# EAGLE design DE0_Digital_IO_Wing (EAGLE 6.6.0)
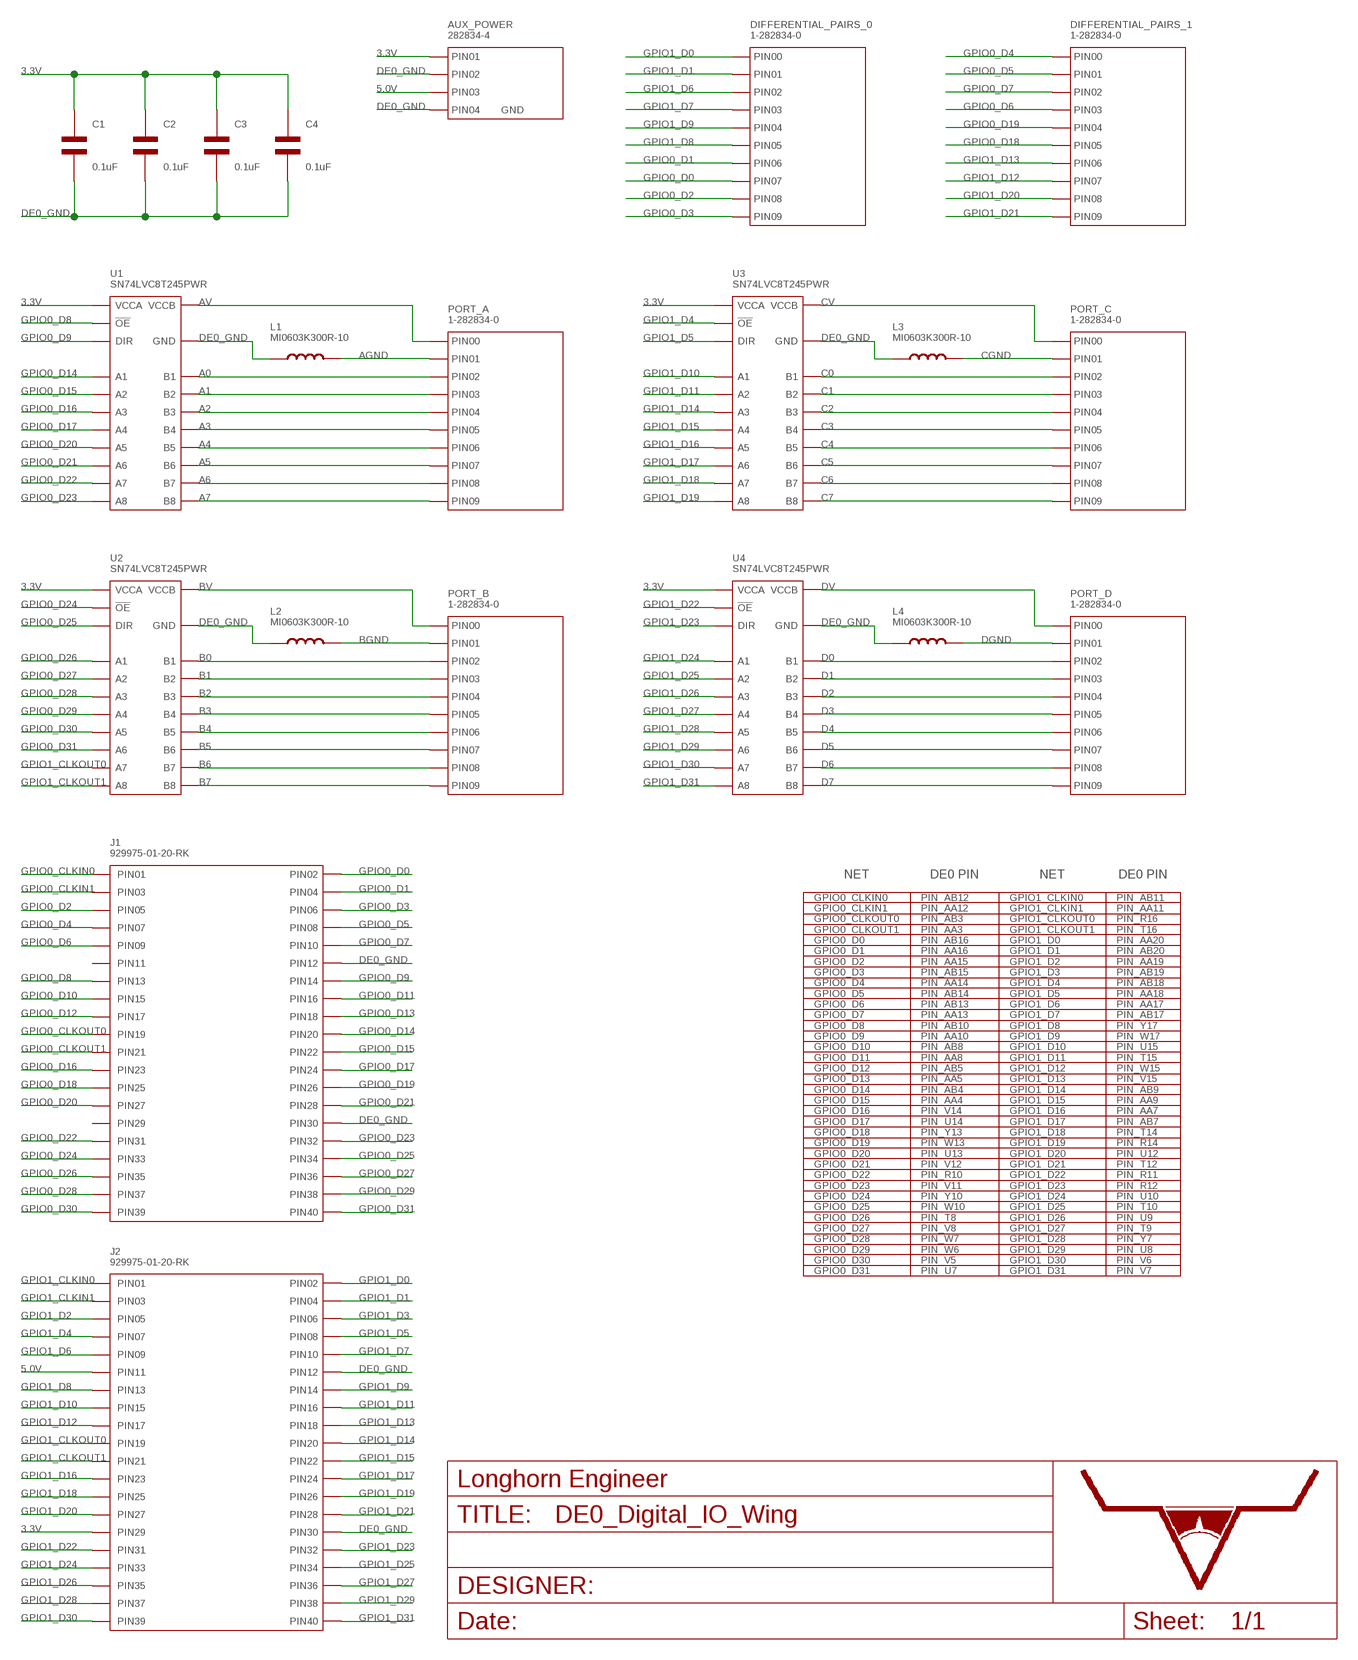
[diagram p0: schematic, sheet 1]

## Parts
AUX_POWER  282834-4  CON_01X04_282834-4  [282834-4]
C1  0.1uF  CAPACITOR_NP_0805  [C0805]
C2  0.1uF  CAPACITOR_NP_0805  [C0805]
C3  0.1uF  CAPACITOR_NP_0805  [C0805]
C4  0.1uF  CAPACITOR_NP_0805  [C0805]
DIFFERENTIAL_PAIRS_0  1-282834-0  PH_1X101-282834-0  [1-282834-0]
DIFFERENTIAL_PAIRS_1  1-282834-0  PH_1X101-282834-0  [1-282834-0]
FRAME  LHE_FRAME  [LHE_FRAME]
J1  929975-01-20-RK  CON_02X202.54MM_PIN_HEADER  [2.54MM_02X20_PIN_HEADER]
J2  929975-01-20-RK  CON_02X202.54MM_PIN_HEADER  [2.54MM_02X20_PIN_HEADER]
L1  MI0603K300R-10  INDUCTOR_0603  [L0603]
L2  MI0603K300R-10  INDUCTOR_0603  [L0603]
L3  MI0603K300R-10  INDUCTOR_0603  [L0603]
L4  MI0603K300R-10  INDUCTOR_0603  [L0603]
PORT_A  1-282834-0  PH_1X101-282834-0  [1-282834-0]
PORT_B  1-282834-0  PH_1X101-282834-0  [1-282834-0]
PORT_C  1-282834-0  PH_1X101-282834-0  [1-282834-0]
PORT_D  1-282834-0  PH_1X101-282834-0  [1-282834-0]
U1  SN74LVC8T245PWR  [SN74LVC8T245_TTSOP-24]
U2  SN74LVC8T245PWR  [SN74LVC8T245_TTSOP-24]
U3  SN74LVC8T245PWR  [SN74LVC8T245_TTSOP-24]
U4  SN74LVC8T245PWR  [SN74LVC8T245_TTSOP-24]

## Nets
3.3V: AUX_POWER.P$1 C1.P$1 C2.P$1 C3.P$1 C4.P$1 J2.29 U1.P$1(VCCA) U2.P$1(VCCA) U3.P$1(VCCA) U4.P$1(VCCA)
5.0V: AUX_POWER.P$3 J2.11
A0: PORT_A.P$3 U1.P$21(B1)
A1: PORT_A.P$4 U1.P$20(B2)
A2: PORT_A.P$5 U1.P$19(B3)
A3: PORT_A.P$6 U1.P$18(B4)
A4: PORT_A.P$7 U1.P$17(B5)
A5: PORT_A.P$8 U1.P$16(B6)
A6: PORT_A.P$9 U1.P$15(B7)
A7: PORT_A.P$10 U1.P$14(B8)
AGND: L1.P$2 PORT_A.P$2
AV: PORT_A.P$1 U1.P$23(VCCB) U1.P$24(VCCB)
B0: PORT_B.P$3 U2.P$21(B1)
B1: PORT_B.P$4 U2.P$20(B2)
B2: PORT_B.P$5 U2.P$19(B3)
B3: PORT_B.P$6 U2.P$18(B4)
B4: PORT_B.P$7 U2.P$17(B5)
B5: PORT_B.P$8 U2.P$16(B6)
B6: PORT_B.P$9 U2.P$15(B7)
B7: PORT_B.P$10 U2.P$14(B8)
BGND: L2.P$2 PORT_B.P$2
BV: PORT_B.P$1 U2.P$23(VCCB) U2.P$24(VCCB)
C0: PORT_C.P$3 U3.P$21(B1)
C1: PORT_C.P$4 U3.P$20(B2)
C2: PORT_C.P$5 U3.P$19(B3)
C3: PORT_C.P$6 U3.P$18(B4)
C4: PORT_C.P$7 U3.P$17(B5)
C5: PORT_C.P$8 U3.P$16(B6)
C6: PORT_C.P$9 U3.P$15(B7)
C7: PORT_C.P$10 U3.P$14(B8)
CGND: L3.P$2 PORT_C.P$2
CV: PORT_C.P$1 U3.P$23(VCCB) U3.P$24(VCCB)
D0: PORT_D.P$3 U4.P$21(B1)
D1: PORT_D.P$4 U4.P$20(B2)
D2: PORT_D.P$5 U4.P$19(B3)
D3: PORT_D.P$6 U4.P$18(B4)
D4: PORT_D.P$7 U4.P$17(B5)
D5: PORT_D.P$8 U4.P$16(B6)
D6: PORT_D.P$9 U4.P$15(B7)
D7: PORT_D.P$10 U4.P$14(B8)
DE0_GND: AUX_POWER.P$2 AUX_POWER.P$4 C1.P$2 C2.P$2 C3.P$2 C4.P$2 J1.12 J1.30 J2.12 J2.30 L1.P$1 L2.P$1 L3.P$1 L4.P$1 U1.P$11(GND) U1.P$12(GND) U1.P$13(GND) U2.P$11(GND) U2.P$12(GND) U2.P$13(GND) U3.P$11(GND) U3.P$12(GND) U3.P$13(GND) U4.P$11(GND) U4.P$12(GND) U4.P$13(GND)
DGND: L4.P$2 PORT_D.P$2
DV: PORT_D.P$1 U4.P$23(VCCB) U4.P$24(VCCB)
GPIO0_CLKIN0: J1.1
GPIO0_CLKIN1: J1.3
GPIO0_CLKOUT0: J1.19
GPIO0_CLKOUT1: J1.21
GPIO0_D0: DIFFERENTIAL_PAIRS_0.P$8 J1.2
GPIO0_D1: DIFFERENTIAL_PAIRS_0.P$7 J1.4
GPIO0_D2: DIFFERENTIAL_PAIRS_0.P$9 J1.5
GPIO0_D3: DIFFERENTIAL_PAIRS_0.P$10 J1.6
GPIO0_D4: DIFFERENTIAL_PAIRS_1.P$1 J1.7
GPIO0_D5: DIFFERENTIAL_PAIRS_1.P$2 J1.8
GPIO0_D6: DIFFERENTIAL_PAIRS_1.P$4 J1.9
GPIO0_D7: DIFFERENTIAL_PAIRS_1.P$3 J1.10
GPIO0_D8: J1.13 U1.P$22(!OE)
GPIO0_D9: J1.14 U1.P$2(DIR)
GPIO0_D10: J1.15
GPIO0_D11: J1.16
GPIO0_D12: J1.17
GPIO0_D13: J1.18
GPIO0_D14: J1.20 U1.P$3(A1)
GPIO0_D15: J1.22 U1.P$4(A2)
GPIO0_D16: J1.23 U1.P$5(A3)
GPIO0_D17: J1.24 U1.P$6(A4)
GPIO0_D18: DIFFERENTIAL_PAIRS_1.P$6 J1.25
GPIO0_D19: DIFFERENTIAL_PAIRS_1.P$5 J1.26
GPIO0_D20: J1.27 U1.P$7(A5)
GPIO0_D21: J1.28 U1.P$8(A6)
GPIO0_D22: J1.31 U1.P$9(A7)
GPIO0_D23: J1.32 U1.P$10(A8)
GPIO0_D24: J1.33 U2.P$22(!OE)
GPIO0_D25: J1.34 U2.P$2(DIR)
GPIO0_D26: J1.35 U2.P$3(A1)
GPIO0_D27: J1.36 U2.P$4(A2)
GPIO0_D28: J1.37 U2.P$5(A3)
GPIO0_D29: J1.38 U2.P$6(A4)
GPIO0_D30: J1.39 U2.P$7(A5)
GPIO0_D31: J1.40 U2.P$8(A6)
GPIO1_CLKIN0: J2.1
GPIO1_CLKIN1: J2.3
GPIO1_CLKOUT0: J2.19 U2.P$9(A7)
GPIO1_CLKOUT1: J2.21 U2.P$10(A8)
GPIO1_D0: DIFFERENTIAL_PAIRS_0.P$1 J2.2
GPIO1_D1: DIFFERENTIAL_PAIRS_0.P$2 J2.4
GPIO1_D2: J2.5
GPIO1_D3: J2.6
GPIO1_D4: J2.7 U3.P$22(!OE)
GPIO1_D5: J2.8 U3.P$2(DIR)
GPIO1_D6: DIFFERENTIAL_PAIRS_0.P$3 J2.9
GPIO1_D7: DIFFERENTIAL_PAIRS_0.P$4 J2.10
GPIO1_D8: DIFFERENTIAL_PAIRS_0.P$6 J2.13
GPIO1_D9: DIFFERENTIAL_PAIRS_0.P$5 J2.14
GPIO1_D10: J2.15 U3.P$3(A1)
GPIO1_D11: J2.16 U3.P$4(A2)
GPIO1_D12: DIFFERENTIAL_PAIRS_1.P$8 J2.17
GPIO1_D13: DIFFERENTIAL_PAIRS_1.P$7 J2.18
GPIO1_D14: J2.20 U3.P$5(A3)
GPIO1_D15: J2.22 U3.P$6(A4)
GPIO1_D16: J2.23 U3.P$7(A5)
GPIO1_D17: J2.24 U3.P$8(A6)
GPIO1_D18: J2.25 U3.P$9(A7)
GPIO1_D19: J2.26 U3.P$10(A8)
GPIO1_D20: DIFFERENTIAL_PAIRS_1.P$9 J2.27
GPIO1_D21: DIFFERENTIAL_PAIRS_1.P$10 J2.28
GPIO1_D22: J2.31 U4.P$22(!OE)
GPIO1_D23: J2.32 U4.P$2(DIR)
GPIO1_D24: J2.33 U4.P$3(A1)
GPIO1_D25: J2.34 U4.P$4(A2)
GPIO1_D26: J2.35 U4.P$5(A3)
GPIO1_D27: J2.36 U4.P$6(A4)
GPIO1_D28: J2.37 U4.P$7(A5)
GPIO1_D29: J2.38 U4.P$8(A6)
GPIO1_D30: J2.39 U4.P$9(A7)
GPIO1_D31: J2.40 U4.P$10(A8)
Unconnected: J1.11 J1.29

## Notes on the sheet
- NET | DE0 PIN | NET | DE0 PIN
- GPIO0_CLKIN0
  GPIO0_CLKIN1
  GPIO0_CLKOUT0
  GPIO0_CLKOUT1
  GPIO0_D0
  GPIO0_D1
  GPIO0_D2
  GPIO0_D3
  GPIO0_D4
  GPIO0_D5
  GPIO0_D6
  GPIO0_D7
  GPIO0_D8
  GPIO0_D9
  GPIO0_D10
  GPIO0_D11
  GPIO0_D12
  GPIO0_D13
  GPIO0_D14
  GPIO0_D15
  GPIO0_D16
  GPIO0_D17
  GPIO0_D18
  GPIO0_D19
  GPIO0_D20
  GPIO0_D21
  GPIO0_D22
  GPIO0_D23
  GPIO0_D24
  GPIO0_D25
  GPIO0_D26
  GPIO0_D27
  GPIO0_D28
  GPIO0_D29
  GPIO0_D30
  GPIO0_D31
- PIN_AB12
  PIN_AA12
  PIN_AB3
  PIN_AA3
  PIN_AB16
  PIN_AA16
  PIN_AA15
  PIN_AB15
  PIN_AA14
  PIN_AB14
  PIN_AB13
  PIN_AA13
  PIN_AB10
  PIN_AA10
  PIN_AB8
  PIN_AA8
  PIN_AB5
  PIN_AA5
  PIN_AB4
  PIN_AA4
  PIN_V14
  PIN_U14
  PIN_Y13
  PIN_W13
  PIN_U13
  PIN_V12
  PIN_R10
  PIN_V11
  PIN_Y10
  PIN_W10
  PIN_T8
  PIN_V8
  PIN_W7
  PIN_W6
  PIN_V5
  PIN_U7
- GPIO1_CLKIN0
  GPIO1_CLKIN1
  GPIO1_CLKOUT0
  GPIO1_CLKOUT1
  GPIO1_D0
  GPIO1_D1
  GPIO1_D2
  GPIO1_D3
  GPIO1_D4
  GPIO1_D5
  GPIO1_D6
  GPIO1_D7
  GPIO1_D8
  GPIO1_D9
  GPIO1_D10
  GPIO1_D11
  GPIO1_D12
  GPIO1_D13
  GPIO1_D14
  GPIO1_D15
  GPIO1_D16
  GPIO1_D17
  GPIO1_D18
  GPIO1_D19
  GPIO1_D20
  GPIO1_D21
  GPIO1_D22
  GPIO1_D23
  GPIO1_D24
  GPIO1_D25
  GPIO1_D26
  GPIO1_D27
  GPIO1_D28
  GPIO1_D29
  GPIO1_D30
  GPIO1_D31
- PIN_AB11
  PIN_AA11
  PIN_R16
  PIN_T16
  PIN_AA20
  PIN_AB20
  PIN_AA19
  PIN_AB19
  PIN_AB18
  PIN_AA18
  PIN_AA17
  PIN_AB17
  PIN_Y17
  PIN_W17
  PIN_U15
  PIN_T15
  PIN_W15
  PIN_V15
  PIN_AB9
  PIN_AA9
  PIN_AA7
  PIN_AB7
  PIN_T14
  PIN_R14
  PIN_U12
  PIN_T12
  PIN_R11
  PIN_R12
  PIN_U10
  PIN_T10
  PIN_U9
  PIN_T9
  PIN_Y7
  PIN_U8
  PIN_V6
  PIN_V7

## Library data of the parts
AUX_POWER = PP_Connectors:CON_01X04: 4 Pin Connectors; LABEL01: 3.3V; LABEL02: GND; LABEL03: 5V; LABEL04: GND
C1-C4 = MF_Passives:CAPACITOR_NP: Library: MF_Passives Description: Device for Non-Polarized Capacitors. Manufacture part number (MFG#), Voltage, Temperature Coefficient, and Tolerance can be added via Attributes.; MFG#: N/A; TEMP_COF: N/A; TOLERANCE: N/A; VOLTAGE: N/A
DIFFERENTIAL_PAIRS_0 = PP_Connectors:PH_1X10; LABEL00: + (AA20); LABEL01: - (AB20); LABEL02: + (AA17); LABEL03: - (AB17); LABEL04: + (W17); LABEL05: - (Y17); LABEL06: + (AA16); LABEL07: - (AB16); LABEL08: + (AA15); LABEL09: - (AB15)
DIFFERENTIAL_PAIRS_1 = PP_Connectors:PH_1X10; LABEL00: + (AA14); LABEL01: - (AB14); LABEL02: + (AA13); LABEL03: - (AB13); LABEL04: + (W13); LABEL05: - (Y13); LABEL06: + (V15); LABEL07: - (W15); LABEL08: + (U12); LABEL09: - (T12)
FRAME = PP_Aesthetics:LHE_FRAME; DNAME: Parker Dillmann; REVNUM: REV: 0
J1 J2 = PP_Connectors:CON_02X20
L1-L4 = MF_Passives:INDUCTOR: Library: MF_Passives Description: Device for Inductors. Manufacture part number (MFG#) can be added via Attributes.; MFG#: N/A
PORT_A = PP_Connectors:PH_1X10; LABEL00: A_VREF; LABEL01: A_GND; LABEL02: A0 (AB4); LABEL03: A1 (AA4); LABEL04: A2 (V14); LABEL05: A3 (U14); LABEL06: A4 (U13); LABEL07: A5 (V12); LABEL08: A6 (R10); LABEL09: A7 (V11)
PORT_B = PP_Connectors:PH_1X10; LABEL00: B_VREF; LABEL01: B_GND; LABEL02: B0 (T8); LABEL03: B1 (V8); LABEL04: B2 (W7); LABEL05: B3 (W6); LABEL06: B4 (V5); LABEL07: B5 (U7); LABEL08: B6 (AA19); LABEL09: B7 (AB19)
PORT_C = PP_Connectors:PH_1X10; LABEL00: C_VREF; LABEL01: C_GND; LABEL02: C0 (U15); LABEL03: C1 (T15); LABEL04: C2 (AB9); LABEL05: C3 (AA9); LABEL06: C4 (AA7); LABEL07: C5 (AB7); LABEL08: C6 (T14); LABEL09: C7 (R14)
PORT_D = PP_Connectors:PH_1X10; LABEL00: D_VREF; LABEL01: D_GND; LABEL02: D0 (U10); LABEL03: D1 (T10); LABEL04: D2 (U9); LABEL05: D3 (T9); LABEL06: D4 (Y7); LABEL07: D5 (U8); LABEL08: D6 (V6); LABEL09: D7 (V7)
U1-U4 = PP_DigitalIC:SN74LVC8T245: Manufacturer Part #: SN74LVC8T245 Manufacturer: Texas Instruments Description: Translation - Voltage Levels 8-Bit Dual-Supply Bus Xcvr

## Board
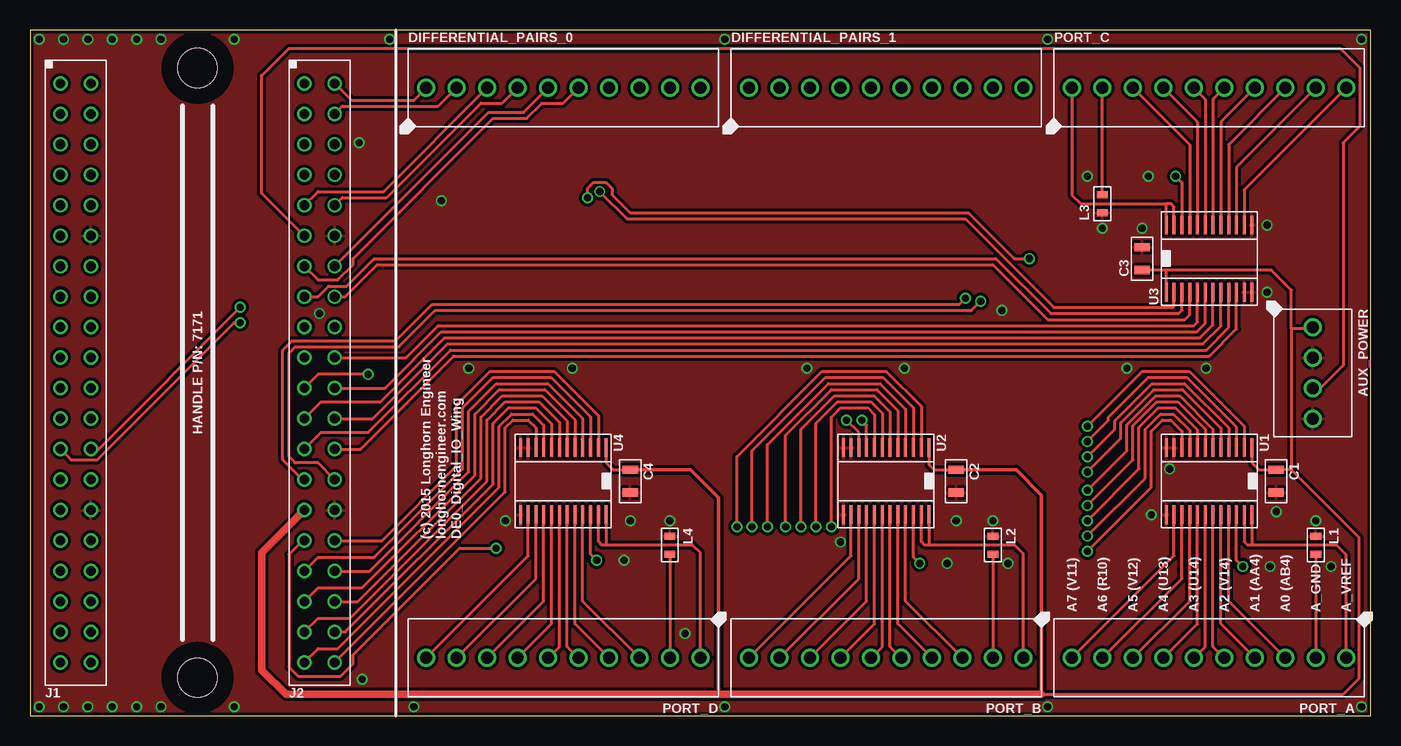
[diagram p1: board, top side]
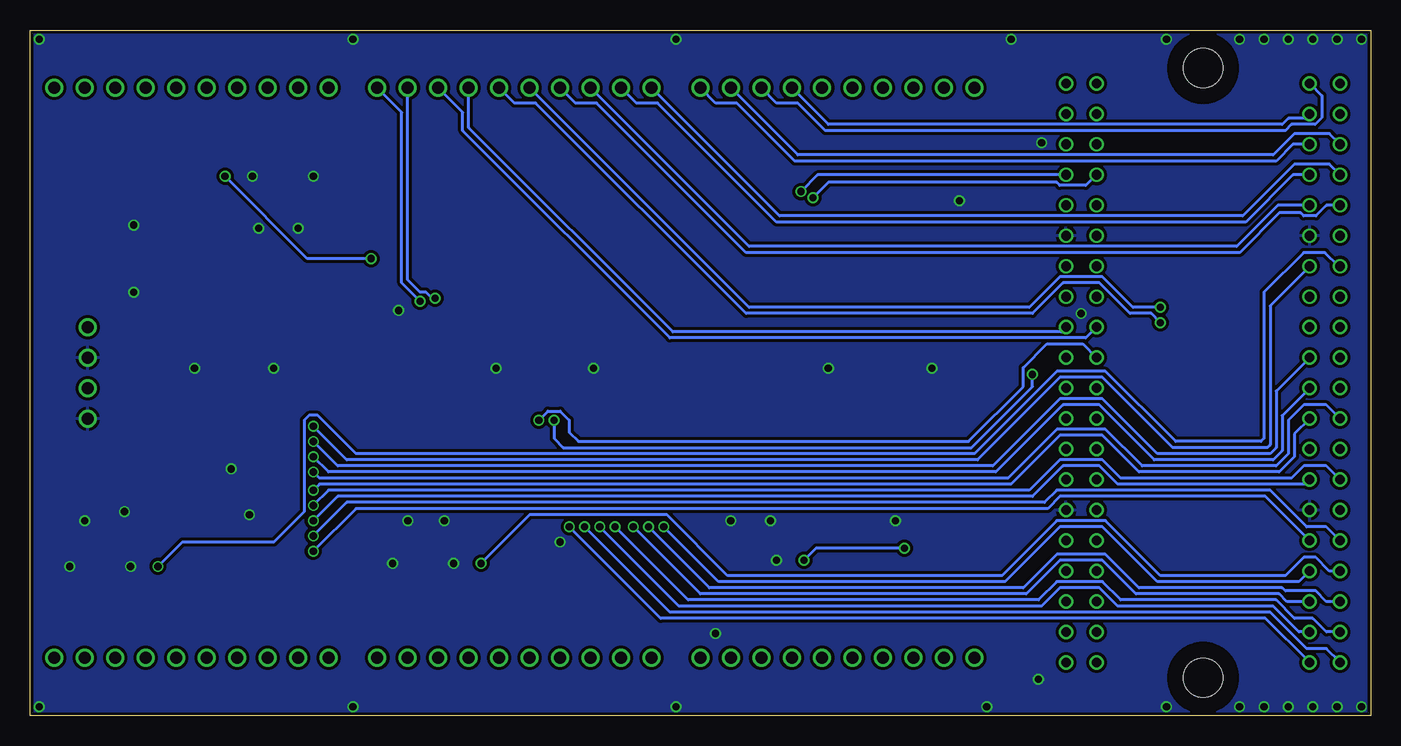
[diagram p2: board, bottom side, seen from below]

Size 111.76 x 57.15 mm. Coordinates in mm from the lower left corner, seen from the top.
Outline: 0,0 111.76,0 111.76,57.15 0,57.15 0,0
Copper layers (1*16): Top 0.035mm / dielectric 0.2mm / Bottom 0.035mm
Design rules "MF_2_Layer": minimum track width 6mil, minimum drill 12mil, track to track 6mil, track to pad 6mil, pad to pad 6mil, via to via 6mil, smd to smd 0mil, copper to edge 10mil, drill to drill 10mil, minimum pad ring 6mil, minimum via ring 6mil, stop-mask expansion 2mil, vias tented up to drill 25mil, thermal gap 10mil
Holes 3.26 mm at 13.97,53.98 13.97,3.17
tRestrict: area 11.4,0.6 to 16.5,5.7; area 11.4,51.4 to 16.5,56.5
bRestrict: area 11.4,51.4 to 16.5,56.5; area 11.4,0.6 to 16.5,5.7

### Footprints (pad centres in the part's own frame; a part is rotated, then mirrored left to right if it is on the bottom)
282834-4 = drill 1: P$1 -3.81,0; P$2 -1.27,0; P$3 1.27,0; P$4 3.81,0
C0805 = smd 0.7 x 1.3: P$1 -0.95,0; P$2 0.95,0
1-282834-0 = drill 1: P$1 -11.43,0; P$2 -8.89,0; P$3 -6.35,0; P$4 -3.81,0; P$5 -1.27,0; P$6 1.27,0; P$7 3.81,0; P$8 6.35,0; P$9 8.89,0; P$10 11.43,0
2.54MM_02X20_PIN_HEADER = drill 0.8: 1 -1.27,24.13; 2 1.27,24.13; 3 -1.27,21.59; 4 1.27,21.59; 5 -1.27,19.05; 6 1.27,19.05; 7 -1.27,16.51; 8 1.27,16.51; 9 -1.27,13.97; 10 1.27,13.97; 11 -1.27,11.43; 12 1.27,11.43; 13 -1.27,8.89; 14 1.27,8.89; 15 -1.27,6.35; 16 1.27,6.35; 17 -1.27,3.81; 18 1.27,3.81; 19 -1.27,1.27; 20 1.27,1.27; 21 -1.27,-1.27; 22 1.27,-1.27; 23 -1.27,-3.81; 24 1.27,-3.81; 25 -1.27,-6.35; 26 1.27,-6.35; 27 -1.27,-8.89; 28 1.27,-8.89; 29 -1.27,-11.43; 30 1.27,-11.43; 31 -1.27,-13.97; 32 1.27,-13.97; 33 -1.27,-16.51; 34 1.27,-16.51; 35 -1.27,-19.05; 36 1.27,-19.05; 37 -1.27,-21.59; 38 1.27,-21.59; 39 -1.27,-24.13; 40 1.27,-24.13
L0603 = smd 0.6 x 0.9: P$1 -0.75,0; P$2 0.75,0
SN74LVC8T245_TTSOP-24 = smd 1.55 x 0.25: P$1 -2.8,3.575; P$2 -2.8,2.925; P$3 -2.8,2.275; P$4 -2.8,1.625; P$5 -2.8,0.975; P$6 -2.8,0.325; P$7 -2.8,-0.325; P$8 -2.8,-0.975; P$9 -2.8,-1.625; P$10 -2.8,-2.275; P$11 -2.8,-2.925; P$12 -2.8,-3.575; P$13 2.8,-3.575; P$14 2.8,-2.925; P$15 2.8,-2.275; P$16 2.8,-1.625; P$17 2.8,-0.975; P$18 2.8,-0.325; P$19 2.8,0.325; P$20 2.8,0.975; P$21 2.8,1.625; P$22 2.8,2.275; P$23 2.8,2.925; P$24 2.8,3.575

### Placement (x,y rotation side)
AUX_POWER  106.93,28.57 270 top
C1  103.89,19.56 270 top
C2  77.22,19.56 270 top
C3  92.71,38.1 90 top
C4  50.04,19.56 270 top
DIFFERENTIAL_PAIRS_0  44.45,52.32 0 top
DIFFERENTIAL_PAIRS_1  71.37,52.32 0 top
FRAME  38.48,14.73 90 top
J1  3.81,28.57 0 top
J2  24.13,28.57 0 top
L1  107.19,14.22 270 top
L2  80.26,14.22 270 top
L3  89.41,42.67 90 top
L4  53.34,14.22 270 top
PORT_A  98.3,4.83 180 top
PORT_B  71.37,4.83 180 top
PORT_C  98.3,52.32 0 top
PORT_D  44.45,4.83 180 top
U1  98.3,19.56 270 top
U2  71.37,19.56 270 top
U3  98.3,38.1 90 top
U4  44.45,19.56 270 top

### Tracks (layer width: path | path; a pad name or v marks a point on that pad's centre or on a via)
3.3V
  Top 0.254: 105.16,20.51 110.81,14.86 110.81,3.11 109.47,1.78 84.33,1.78 | 105.16,20.51 C1.P$1 102.46,20.51 101.87,21.09 U1.P$1 | U4.P$1 48.02,21.09 48.61,20.51 C4.P$1 | U2.P$1 74.95,20.91 75.35,20.51 C2.P$1 | U3.P$1 94.72,37.15 | 94.72,37.15 C3.P$1 | 105.16,32.26 105.16,35.48 103.49,37.15 94.72,37.15 | 105.16,32.26 105.16,20.51 | 105.16,32.26 106.93,32.26 AUX_POWER.P$1
  Top 0.305: C4.P$1 55.06,20.51 57.4,18.17 57.4,1.78 | C2.P$1 82.22,20.51 84.33,18.4 84.33,1.78
  Top 0.61: J2.29 19.3,13.59 19.3,3.81 21.34,1.78 57.4,1.78 84.33,1.78
5.0V
  Top 0.254: J2.11 19.3,43.56 19.3,53.34 21.59,55.63 109.22,55.63 110.86,53.99 110.86,49.14 109.47,47.75 109.47,29.21 107.57,27.3 AUX_POWER.P$3
A0
  Top 0.254: PORT_A.P$3 99.92,9.55 U1.P$21
A1
  Top 0.254: PORT_A.P$4 99.27,7.66 U1.P$20
A2
  Top 0.254: PORT_A.P$5 98.62,5.77 U1.P$19
A3
  Top 0.254: PORT_A.P$6 97.97,5.77 U1.P$18
A4
  Top 0.254: PORT_A.P$7 97.32,7.66 U1.P$17
A5
  Top 0.254: PORT_A.P$8 96.67,9.55 U1.P$16
A6
  Top 0.254: PORT_A.P$9 96.02,11.44 U1.P$15
A7
  Top 0.254: PORT_A.P$10 95.37,13.33 U1.P$14
AGND
  Top 0.254: L1.P$2 PORT_A.P$2
AV
  Top 0.254: PORT_A.P$1 109.73,13.42 108.92,14.22 101.87,14.22 | 101.87,14.22 101.5,14.22 101.22,14.51 U1.P$23 | U1.P$24 101.87,14.22
B0
  Top 0.254: PORT_B.P$3 73,9.55 U2.P$21
B1
  Top 0.254: PORT_B.P$4 72.35,7.66 U2.P$20
B2
  Top 0.254: PORT_B.P$5 71.7,5.77 U2.P$19
B3
  Top 0.254: PORT_B.P$6 71.05,5.77 U2.P$18
B4
  Top 0.254: PORT_B.P$7 70.4,7.66 U2.P$17
B5
  Top 0.254: PORT_B.P$8 69.75,9.55 U2.P$16
B6
  Top 0.254: PORT_B.P$9 69.1,11.44 U2.P$15
B7
  Top 0.254: PORT_B.P$10 68.45,13.33 U2.P$14
BGND
  Top 0.254: L2.P$2 PORT_B.P$2
BV
  Top 0.254: PORT_B.P$1 82.8,13.51 82.09,14.22 74.95,14.22 | 74.95,14.22 74.58,14.22 74.3,14.51 U2.P$23 | U2.P$24 74.95,14.22
C0
  Top 0.254: PORT_C.P$3 96.67,47.6 U3.P$21
C1
  Top 0.254: PORT_C.P$4 97.32,49.49 U3.P$20
C2
  Top 0.254: PORT_C.P$5 97.97,51.38 U3.P$19
C3
  Top 0.254: PORT_C.P$6 98.62,51.38 U3.P$18
C4
  Top 0.254: PORT_C.P$7 99.27,49.49 U3.P$17
C5
  Top 0.254: PORT_C.P$8 99.92,47.6 U3.P$16
C6
  Top 0.254: PORT_C.P$9 100.57,45.71 U3.P$15
C7
  Top 0.254: PORT_C.P$10 101.22,43.82 U3.P$14
CGND
  Top 0.254: L3.P$2 PORT_C.P$2
CV
  Top 0.254: PORT_C.P$1 86.87,43.39 87.59,42.67 94.72,42.67 | U3.P$24 94.72,42.67 | U3.P$23 95.37,42.39 95.09,42.67 94.72,42.67
D0
  Top 0.254: PORT_D.P$3 46.08,9.55 U4.P$21
D1
  Top 0.254: PORT_D.P$4 45.42,7.66 U4.P$20
D2
  Top 0.254: PORT_D.P$5 44.77,5.77 U4.P$19
D3
  Top 0.254: PORT_D.P$6 44.12,5.77 U4.P$18
D4
  Top 0.254: PORT_D.P$7 43.48,7.66 U4.P$17
D5
  Top 0.254: PORT_D.P$8 42.83,9.55 U4.P$16
D6
  Top 0.254: PORT_D.P$9 42.17,11.44 U4.P$15
D7
  Top 0.254: PORT_D.P$10 41.52,13.33 U4.P$14
DE0_GND  (via drill 0.6)
  other vias: 92.71,40.64 89.41,40.64 103.12,35.31 103.12,40.89 107.19,16.26 103.89,17.02 95,20.57 93.47,16.76 77.22,16.26 80.26,16.26 67.56,14.48 39.62,16.26 50.04,16.26 53.34,16.26 0.76,0.76 2.79,0.76 4.83,0.76 6.86,0.76 8.89,0.76 10.92,0.76 0.76,56.39 2.79,56.39 4.83,56.39 6.86,56.39 8.89,56.39 10.92,56.39 111,56.39 111,0.76 32,0.76 57.91,0.76 84.84,0.76 57.91,56.39 29.97,56.39 84.84,56.39 17.02,56.39 17.02,0.76 27.69,3.05 24.13,33.53 27.43,47.75 34.29,42.93 81.03,33.78 76.45,12.7 103.38,12.45 49.53,12.95 93.22,44.96 88.14,44.96 108.46,12.45 81.53,12.7 54.61,6.86 36.58,28.96 45.21,28.96 64.77,28.96 72.9,28.96 91.44,28.96 98.04,28.96
  pour Top (isolate 0.254, rank 6): 111.76,57.15 0,57.15 0,0 111.76,0
  pour Bottom (isolate 0.254, rank 6): 111.76,57.15 0,57.15 0,0 111.76,0
DGND
  Top 0.254: L4.P$2 PORT_D.P$2
DV
  Top 0.254: PORT_D.P$1 55.88,13.59 55.24,14.22 48.02,14.22 | 48.02,14.22 47.66,14.22 47.38,14.51 U4.P$23 | U4.P$24 48.02,14.22
GPIO0_D0
  Bottom 0.254: J1.2 4.06,51.69 4.06,49.84 4.63,49.28 6.6,49.28 7.11,48.77 45.47,48.77 47.75,51.05 49.53,51.05 DIFFERENTIAL_PAIRS_0.P$8
GPIO0_D1
  Bottom 0.254: DIFFERENTIAL_PAIRS_0.P$7 45.21,49.28 7.37,49.28 6.86,49.78 5.46,49.78 J1.4
GPIO0_D2
  Bottom 0.254: J1.5 3.43,48.51 6.35,48.51 8.13,46.74 47.75,46.74 DIFFERENTIAL_PAIRS_0.P$9
GPIO0_D3
  Bottom 0.254: J1.6 6.48,47.62 7.87,46.23 48.01,46.23 52.83,51.05 54.61,51.05 DIFFERENTIAL_PAIRS_0.P$10
GPIO0_D4
  Bottom 0.254: J1.7 3.43,45.97 6.35,45.97 10.67,41.66 49.28,41.66 DIFFERENTIAL_PAIRS_1.P$1
GPIO0_D5
  Bottom 0.254: J1.8 6.48,45.09 10.41,41.15 49.53,41.15 59.44,51.05 61.21,51.05 DIFFERENTIAL_PAIRS_1.P$2
GPIO0_D6
  Bottom 0.254: J1.9 3.68,42.55 4.57,41.66 5.59,41.66 5.84,41.91 7.62,41.91 10.92,38.61 52.07,38.61 64.52,51.05 66.29,51.05 DIFFERENTIAL_PAIRS_1.P$4
GPIO0_D7
  Bottom 0.254: J1.10 7.75,42.55 11.18,39.12 51.82,39.12 DIFFERENTIAL_PAIRS_1.P$3
GPIO0_D8  (via drill 0.6)
  Top 0.254: v101.09,12.45 100.57,12.96 U1.P$22
  Bottom 0.254: J1.13 2.67,37.47 3.81,38.61 5.59,38.61 8.89,35.31 8.89,23.11 9.14,22.86 16.26,22.86 22.1,28.7 26.16,28.7 33.02,21.84 84.58,21.84 87.78,25.04 88.5,25.04 88.9,24.64 88.9,17.02 91.44,14.48 99.06,14.48 v101.09,12.45
GPIO0_D9  (via drill 0.6)
  Top 0.254: v88.14,24.13 92.71,28.7 96.64,28.7 101.22,24.12 U1.P$2
  Bottom 0.254: J1.14 8.38,34.16 8.38,22.61 8.64,22.35 16.51,22.35 22.35,28.19 25.91,28.19 32.77,21.34 85.34,21.34 v88.14,24.13
GPIO0_D14  (via drill 0.6)
  Top 0.254: v88.14,22.86 89.92,24.64 89.92,24.88 93.23,28.19 96.45,28.19 100.57,24.07 U1.P$3
  Bottom 0.254: J1.20 7.87,27.05 7.87,22.35 8.38,21.84 17.78,21.84 22.35,26.42 25.91,26.42 31.5,20.83 86.11,20.83 v88.14,22.86
GPIO0_D15  (via drill 0.6)
  Top 0.254: v88.14,21.59 90.42,23.88 90.42,24.59 93.52,27.69 96.25,27.69 99.92,24.01 U1.P$4
  Bottom 0.254: J1.22 7.37,25.02 7.37,22.1 8.13,21.34 18.03,21.34 22.61,25.91 25.65,25.91 31.24,20.32 86.87,20.32 v88.14,21.59
GPIO0_D16  (via drill 0.6)
  Top 0.254: v88.14,20.32 90.93,23.11 90.93,24.43 93.68,27.18 96.07,27.18 99.27,23.97 U1.P$5
  Bottom 0.254: J1.23 3.68,25.91 5.59,25.91 6.86,24.64 6.86,21.84 7.87,20.83 19.05,20.83 22.1,23.88 26.16,23.88 30.23,19.81 87.63,19.81 v88.14,20.32
GPIO0_D17  (via drill 0.6)
  Top 0.254: v88.14,18.8 91.44,22.1 91.44,24.27 93.84,26.67 95.84,26.67 98.62,23.88 U1.P$6
  Bottom 0.254: J1.24 6.35,23.5 6.35,21.59 7.62,20.32 19.3,20.32 22.35,23.37 25.91,23.37 29.97,19.3 87.63,19.3 v88.14,18.8
GPIO0_D18  (via drill 0.6)
  Top 0.254: J1.25 3.43,21.34 5.59,21.34 17.02,32.77 v17.53,32.77 17.27,32.77
  Bottom 0.254: v17.53,32.77 18.29,33.53 20.07,33.53 22.61,36.07 25.65,36.07 28.19,33.53 52.07,33.53 69.6,51.05 71.37,51.05 DIFFERENTIAL_PAIRS_1.P$6
GPIO0_D19  (via drill 0.6)
  Top 0.254: J1.26 5.71,22.23 v17.53,34.04
  Bottom 0.254: v17.53,34.04 19.81,34.04 22.35,36.58 25.91,36.58 28.45,34.04 51.82,34.04 DIFFERENTIAL_PAIRS_1.P$5
GPIO0_D20  (via drill 0.6)
  Top 0.254: v88.14,17.53 91.95,21.34 91.95,24.18 93.93,26.16 95.68,26.16 97.97,23.87 U1.P$7
  Bottom 0.254: J1.27 3.68,20.83 5.59,20.83 6.6,19.81 20.83,19.81 22.35,21.34 25.91,21.34 28.45,18.8 86.87,18.8 v88.14,17.53
GPIO0_D21  (via drill 0.6)
  Top 0.254: v88.14,16.26 92.46,20.57 92.46,24.03 94.08,25.65 95.5,25.65 97.32,23.83 U1.P$8
  Bottom 0.254: J1.28 5.46,19.3 21.08,19.3 22.61,20.83 25.65,20.83 28.19,18.29 86.11,18.29 v88.14,16.26
GPIO0_D22  (via drill 0.6)
  Top 0.254: v88.14,14.99 92.96,19.81 92.96,23.88 94.23,25.15 95.31,25.15 96.67,23.78 U1.P$9
  Bottom 0.254: J1.31 3.68,15.75 5.33,15.75 8.38,18.8 26.16,18.8 27.18,17.78 85.34,17.78 v88.14,14.99
GPIO0_D23  (via drill 0.6)
  Top 0.254: v88.14,13.72 93.47,19.05 93.47,23.72 94.39,24.64 95.1,24.64 96.02,23.72 U1.P$10
  Bottom 0.254: J1.32 8.76,18.29 25.91,18.29 26.92,17.27 84.58,17.27 v88.14,13.72
GPIO0_D24  (via drill 0.6)
  Top 0.254: v74.17,12.7 73.65,13.22 U2.P$22
  Bottom 0.254: J1.33 3.43,12.06 4.57,13.21 5.59,13.21 7.11,11.68 17.53,11.68 22.1,16.26 26.16,16.26 30.73,11.68 53.59,11.68 58.67,16.76 70.1,16.76 v74.17,12.7
GPIO0_D25  (via drill 0.6)
  Top 0.254: v58.93,15.75 58.93,21.59 66.04,28.7 71.37,28.7 74.3,25.78 U2.P$2
  Bottom 0.254: J1.34 5.97,11.18 17.78,11.18 22.35,15.75 25.91,15.75 30.48,11.18 54.36,11.18 v58.93,15.75
GPIO0_D26  (via drill 0.6)
  Top 0.254: v60.2,15.75 60.2,22.1 66.29,28.19 71.12,28.19 73.65,25.66 U2.P$3
  Bottom 0.254: J1.35 3.68,9.53 4.57,10.41 7.11,10.41 7.37,10.67 19.3,10.67 22.1,13.46 26.16,13.46 28.96,10.67 55.12,10.67 v60.2,15.75
GPIO0_D27  (via drill 0.6)
  Top 0.254: v61.47,15.75 61.47,22.61 66.55,27.69 70.87,27.69 73,25.55 U2.P$4
  Bottom 0.254: J1.36 6.99,9.53 7.62,10.16 19.56,10.16 22.35,12.95 25.91,12.95 28.7,10.16 55.88,10.16 v61.47,15.75
GPIO0_D28  (via drill 0.6)
  Top 0.254: v62.99,15.75 62.99,23.37 66.8,27.18 70.61,27.18 72.35,25.44 U2.P$5
  Bottom 0.254: J1.37 3.68,6.99 4.83,8.13 6.35,8.13 7.87,9.65 20.83,9.65 22.35,11.18 26.16,11.18 27.69,9.65 56.9,9.65 v62.99,15.75
GPIO0_D29  (via drill 0.6)
  Top 0.254: v64.26,15.75 64.26,23.88 67.06,26.67 70.36,26.67 71.7,25.33 U2.P$6
  Bottom 0.254: J1.38 5.97,6.99 8.13,9.14 21.08,9.14 22.61,10.67 25.91,10.67 27.43,9.14 57.66,9.14 v64.26,15.75
GPIO0_D30  (via drill 0.6)
  Top 0.254: v65.53,15.75 65.53,24.38 67.31,26.16 70.1,26.16 71.05,25.22 U2.P$7
  Bottom 0.254: J1.39 3.68,5.59 5.33,5.59 8.38,8.64 58.42,8.64 v65.53,15.75
GPIO0_D31  (via drill 0.6)
  Top 0.254: v66.8,15.75 66.8,24.89 67.56,25.65 69.85,25.65 70.4,25.11 U2.P$8
  Bottom 0.254: J1.40 8.76,8.13 59.18,8.13 v66.8,15.75
GPIO1_CLKOUT0  (via drill 0.6)
  Top 0.254: U2.P$9 69.75,24.23 v69.34,24.64
  Bottom 0.254: v69.34,24.64 68.58,25.4 67.56,25.4 66.8,24.64 66.8,23.62 66.04,22.86 33.53,22.86 28.96,27.43 28.96,29 26.97,30.99 24,30.99 J2.19
GPIO1_CLKOUT1  (via drill 0.6)
  Top 0.254: U2.P$10 69.1,23.61 v68.07,24.64 | v28.19,28.45 24,28.45 J2.21
  Bottom 0.254: v68.07,24.64 68.07,23.11 67.31,22.35 33.27,22.35 28.19,27.43 v28.19,28.45
GPIO1_D0
  Top 0.254: J2.2 26.8,51.31 32,51.31 DIFFERENTIAL_PAIRS_0.P$1
GPIO1_D1
  Top 0.254: J2.4 26.04,50.8 34.04,50.8 DIFFERENTIAL_PAIRS_0.P$2
GPIO1_D4  (via drill 0.6)
  Top 0.254: v46.48,43.18 46.48,43.94 46.99,44.45 48.01,44.45 48.51,43.94 48.51,43.43 50.04,41.91 78.23,41.91 82.04,38.1 v83.31,38.1 | v95.5,44.96 96.02,44.44 U3.P$22
  Bottom 0.254: J2.7 23.75,44.2 25.91,44.2 26.16,44.45 45.21,44.45 v46.48,43.18 | v83.31,38.1 88.65,38.1 v95.5,44.96
GPIO1_D5  (via drill 0.6)
  Top 0.254: v47.5,43.69 49.78,41.4 77.98,41.4 85.34,34.04 95.25,34.04 95.37,34.16 U3.P$2
  Bottom 0.254: J2.8 46.1,45.09 v47.5,43.69
GPIO1_D6
  Top 0.254: J2.9 24,43.69 29.46,43.69 DIFFERENTIAL_PAIRS_0.P$3
GPIO1_D7
  Top 0.254: J2.10 26.04,43.18 29.72,43.18 37.59,51.05 39.37,51.05 DIFFERENTIAL_PAIRS_0.P$4
GPIO1_D8
  Top 0.254: J2.13 24,36.32 25.65,36.32 26.92,37.59 26.92,38.1 38.61,49.78 41.4,49.78 42.67,51.05 44.45,51.05 DIFFERENTIAL_PAIRS_0.P$6
GPIO1_D9
  Top 0.254: J2.14 38.23,50.29 41.15,50.29 DIFFERENTIAL_PAIRS_0.P$5
GPIO1_D10
  Top 0.254: J2.15 24,34.92 24.89,35.81 26.42,35.81 28.7,38.1 80.52,38.1 85.09,33.53 95.76,33.53 96.02,33.79 U3.P$3
GPIO1_D11
  Top 0.254: J2.16 26.29,34.92 28.96,37.59 80.26,37.59 84.84,33.02 96.27,33.02 96.67,33.43 U3.P$4
GPIO1_D12
  Bottom 0.254: J2.17 23.75,31.5 58.42,31.5 75.69,48.77 75.69,50.29 DIFFERENTIAL_PAIRS_1.P$8
GPIO1_D13
  Bottom 0.254: J2.18 25.78,32 58.17,32 75.18,49.02 DIFFERENTIAL_PAIRS_1.P$7
GPIO1_D14
  Top 0.254: J2.20 31.37,29.84 34.04,32.51 97.03,32.51 97.32,32.81 U3.P$5
GPIO1_D15
  Top 0.254: J2.22 29.59,27.3 34.29,32 97.28,32 97.97,32.7 U3.P$6
GPIO1_D16
  Top 0.254: J2.23 24.26,26.16 29.21,26.16 34.54,31.5 97.54,31.5 98.62,32.58 U3.P$7
GPIO1_D17
  Top 0.254: J2.24 28.57,24.77 34.8,30.99 97.79,30.99 99.27,32.47 U3.P$8
GPIO1_D18
  Top 0.254: J2.25 24.26,23.62 28.19,23.62 35.05,30.48 98.04,30.48 99.92,32.36 U3.P$9
GPIO1_D19
  Top 0.254: J2.26 27.56,22.23 35.31,29.97 98.3,29.97 100.57,32.25 U3.P$10
GPIO1_D20  (via drill 0.6)
  Top 0.254: J2.27 22.73,19.68 21.08,21.34 21.08,30.48 21.84,31.24 30.48,31.24 33.53,34.29 77.47,34.29 v77.98,34.8
  Bottom 0.254: v77.98,34.8 78.23,34.8 78.74,35.31 79.25,35.31 80.26,36.32 DIFFERENTIAL_PAIRS_1.P$9
GPIO1_D21  (via drill 0.6)
  Top 0.254: J2.28 24,21.08 22.1,21.08 21.59,21.59 21.59,30.23 22.1,30.73 30.73,30.73 33.78,33.78 78.49,33.78 v79.25,34.54
  Bottom 0.254: v79.25,34.54 80.77,36.07 80.77,50.29 DIFFERENTIAL_PAIRS_1.P$10
GPIO1_D22  (via drill 0.6)
  Top 0.254: J2.31 22.73,14.61 21.59,13.46 21.59,4.06 22.35,3.3 25.91,3.3 26.92,4.32 26.92,5.08 35.81,13.97 v38.86,13.97 | U4.P$22 46.73,13.47 v47.24,12.95
  Bottom 0.254: v38.86,13.97 46.23,13.97 v47.24,12.95
GPIO1_D23
  Top 0.254: U4.P$2 47.38,25.02 43.69,28.7 38.35,28.7 35.56,25.91 35.56,20.83 29.34,14.61 J2.32
GPIO1_D24
  Top 0.254: J2.33 24,13.21 28.7,13.21 36.07,20.57 36.07,25.65 38.61,28.19 43.43,28.19 46.73,24.9 U4.P$3
GPIO1_D25
  Top 0.254: U4.P$4 46.08,24.79 43.18,27.69 38.86,27.69 36.58,25.4 36.58,20.32 28.32,12.06 J2.34
GPIO1_D26
  Top 0.254: J2.35 24,10.67 27.69,10.67 37.08,20.07 37.08,25.15 39.12,27.18 42.93,27.18 45.42,24.68 U4.P$5
GPIO1_D27
  Top 0.254: U4.P$6 44.77,24.57 42.67,26.67 39.37,26.67 37.59,24.89 37.59,19.81 27.3,9.53 J2.36
GPIO1_D28
  Top 0.254: J2.37 24,8.13 26.67,8.13 38.1,19.56 38.1,24.64 39.62,26.16 42.42,26.16 44.12,24.45 U4.P$7
GPIO1_D29
  Top 0.254: U4.P$8 43.48,24.34 42.16,25.65 39.88,25.65 38.61,24.38 38.61,19.3 26.29,6.99 J2.38
GPIO1_D30
  Top 0.254: J2.39 24,5.59 25.65,5.59 39.12,19.05 39.12,24.13 40.13,25.15 41.91,25.15 42.83,24.23 U4.P$9
GPIO1_D31
  Top 0.254: J2.40 39.62,18.67 39.62,24 40.26,24.64 41.54,24.64 42.17,24 U4.P$10

### Text on the board
tPlace: HANDLE P/N: 7171
Document: EDGE OF DE0 FPGA BOARD